# EasyEDA Pro project MAX5864_REUSE.eprj, board PCB1_1
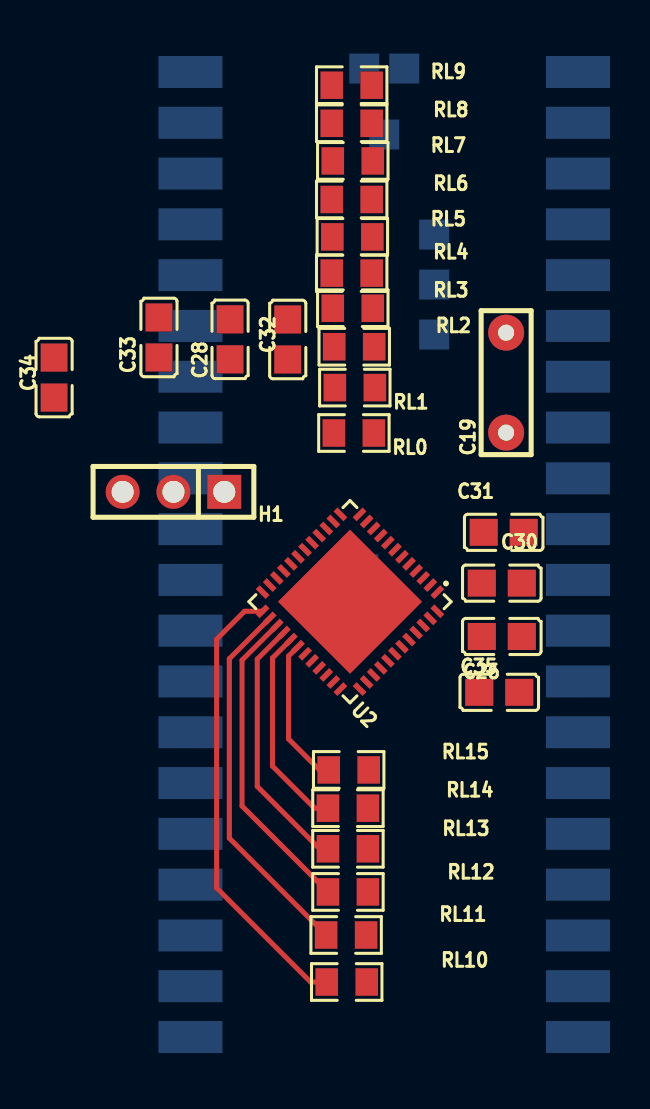
[diagram p16: board, top side]
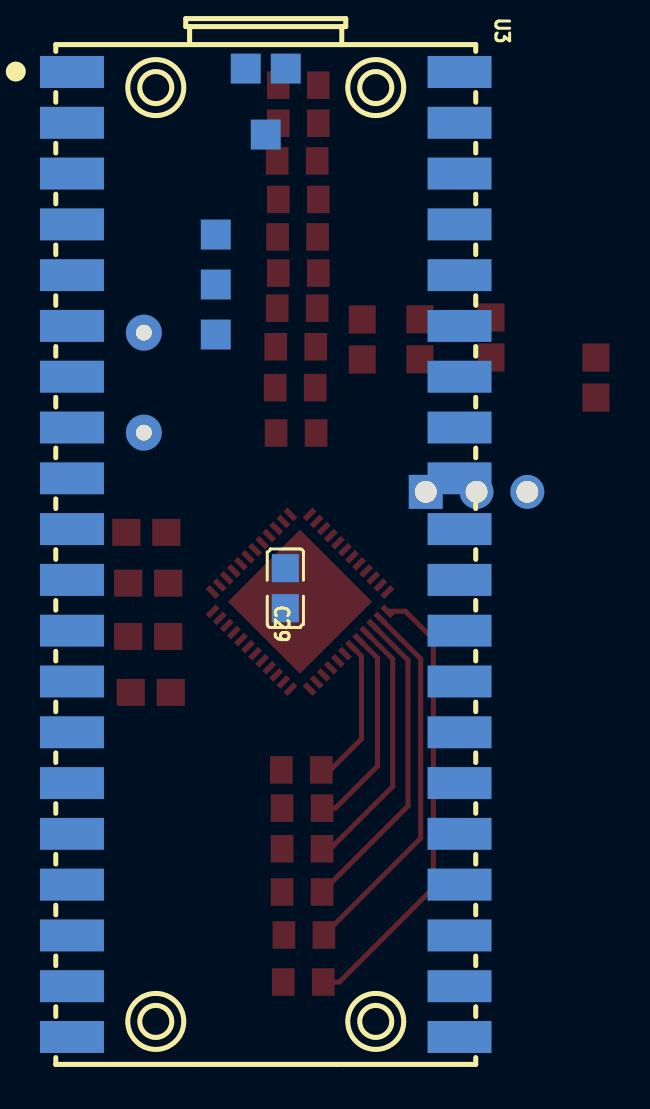
[diagram p17: board, bottom side, seen from below]

No outline. copper layers: Top Layer, Bottom Layer. Coordinates in mm from the lowest, leftmost part position.
Stack: Top Layer 0.035mm / Dielectric1 1.51mm FR4 er 4.5 / Bottom Layer 0.035mm

## Design rules (mm)
template: JLCPCB Capability(Two Layers Board)
spacing copperThickness1oz (default): track to track 0.102, other pairs 0.152 to 0.3
spacing copperThickness2oz: track to track 0.203, other pairs 0.152 to 0.3
track width copperThickness1oz (default): min 0.127, default 0.254, max 2.54
track width copperThickness2oz: min 0.203, default 0.254, max 2.54
differential pair differentialPair (default): width min 0.127, default 0.254, max 2.54; gap min 0.152, default 0.152
via viaSize (default): diameter min 0.5, default 0.61, max 10; hole min 0.3, default 0.305, max 6.3

## Placement (name value [footprint] x y rotation side)
C19  1uF  [CAP-TH_L7.2-W2.5-P5.00-D0.6]  22.61 29.97 90 top
C26  100nF  [C0805]  22.39 17.28 180 top
C28  100nF  [C0805]  8.8 32.14 90 top
C29  100nF  [C0805]  15.53 19.69 90 bottom
C30  100nF  [C0805]  22.39 19.95 0 top
C31  100nF  [C0805]  22.48 22.49 180 top
C32  100nF  [C0805]  11.68 32.13 90 top
C33  100nF  [C0805]  5.24 32.23 270 top
C34  100nF  [C0805]  0 30.23 90 top
C35  100nF  [C0805]  22.26 14.48 0 top
H1  -  [HDR-TH_3P-P2.54-V-M]  5.97 24.51 180 top
RL0  PFC-W0805LF-03-1301-B  [R0805]  14.99 27.45 180 top
RL1  PFC-W0805LF-03-1301-B  [R0805]  15.04 29.72 180 top
RL2  PFC-W0805LF-03-1301-B  [R0805]  15.01 31.77 180 top
RL3  PFC-W0805LF-03-1301-B  [R0805]  14.94 33.69 180 top
RL4  PFC-W0805LF-03-1301-B  [R0805]  14.88 35.45 180 top
RL5  PFC-W0805LF-03-1301-B  [R0805]  14.92 37.26 180 top
RL6  PFC-W0805LF-03-1301-B  [R0805]  14.88 39.13 180 top
RL7  PFC-W0805LF-03-1301-B  [R0805]  14.94 41.06 180 top
RL8  PFC-W0805LF-03-1301-B  [R0805]  14.88 42.94 180 top
RL9  PFC-W0805LF-03-1301-B  [R0805]  14.88 44.85 180 top
RL10  PFC-W0805LF-03-1301-B  [R0805]  14.63 0 180 top
RL11  PFC-W0805LF-03-1301-B  [R0805]  14.6 2.35 180 top
RL12  PFC-W0805LF-03-1301-B  [R0805]  14.69 4.5 180 top
RL13  PFC-W0805LF-03-1301-B  [R0805]  14.69 6.66 180 top
RL14  PFC-W0805LF-03-1301-B  [R0805]  14.69 8.69 180 top
RL15  PFC-W0805LF-03-1301-B  [R0805]  14.73 10.6 180 top
U2  MAX5864ETM+  [QFN-48_L7.0-W7.0-P0.50-BL-EP5.1]  14.8 19.02 135 top
U3  PICO W  [COMM-SMD_L51.0-W21.0-P2.54_PICOW]  16.51 21.46 270 bottom

## Footprints (pads in the part's own frame, mm; a bottom-side part is the same pattern mirrored in y, then rotated)
C0805
  rect 1.41x1.35 smd: 1(-1,0) 2(1,0)
CAP-TH_L7.2-W2.5-P5.00-D0.6
  round 1.8 hole 0.8: 1(-2.499,0) 2(2.499,0)
COMM-SMD_L51.0-W21.0-P2.54_PICOW
  rect 1.6x3.2 smd: 1(-24.045,-9.69) 2(-21.505,-9.69) 3(-18.965,-9.69) 4(-16.425,-9.69) 5(-13.885,-9.69) 6(-11.345,-9.69) 7(-8.805,-9.69) 8(-6.265,-9.69) 9(-3.725,-9.69) 10(-1.185,-9.69) 11(1.355,-9.69) 12(3.895,-9.69) 13(6.435,-9.69) 14(8.975,-9.69) 15(11.515,-9.69) 16(14.055,-9.69) 17(16.595,-9.69) 18(19.135,-9.69) 19(21.675,-9.69) 20(24.215,-9.69) 21(24.215,9.69) 22(21.675,9.69) 23(19.135,9.69) 24(16.595,9.69) 25(14.055,9.69) 26(11.515,9.69) 27(8.975,9.69) 28(6.435,9.69) 29(3.895,9.69) 30(1.355,9.69) 31(-1.185,9.69) 32(-3.725,9.69) 33(-6.265,9.69) 34(-8.805,9.69) 35(-11.345,9.69) 36(-13.885,9.69) 37(-16.425,9.69) 38(-18.965,9.69) 39(-21.505,9.69) 40(-24.045,9.69)
  rect 1.5x1.5 smd: TP1(-20.915,0) TP2(-24.215,1) TP3(-24.215,-1) TP4(-15.915,-2.499) TP5(-13.415,-2.499) TP6(-10.915,-2.499)
HDR-TH_3P-P2.54-V-M
  rect 1.7x1.7 hole 1.1: 1(-2.54,0)
  round 1.7 hole 1.1: 2(0,0) 3(2.54,0)
QFN-48_L7.0-W7.0-P0.50-BL-EP5.1
  rect 0.28x0.7 smd: 1(-2.75,-3.428) 2(-2.25,-3.428) 3(-1.75,-3.428) 4(-1.25,-3.428) 5(-0.75,-3.428) 6(-0.25,-3.428) 7(0.25,-3.428) 8(0.75,-3.428) 9(1.25,-3.428) 10(1.75,-3.428) 11(2.25,-3.428) 12(2.75,-3.428) 25(2.75,3.428) 26(2.25,3.428) 27(1.75,3.428) 28(1.25,3.428) 29(0.75,3.428) 30(0.25,3.428) 31(-0.25,3.428) 32(-0.75,3.428) 33(-1.25,3.428) 34(-1.75,3.428) 35(-2.25,3.428) 36(-2.75,3.428)
  rect 0.7x0.28 smd: 13(3.428,-2.75) 14(3.428,-2.25) 15(3.428,-1.75) 16(3.428,-1.25) 17(3.428,-0.75) 18(3.428,-0.25) 19(3.428,0.25) 20(3.428,0.75) 21(3.428,1.25) 22(3.428,1.75) 23(3.428,2.25) 24(3.428,2.75) 37(-3.428,2.75) 38(-3.428,2.25) 39(-3.428,1.75) 40(-3.428,1.25) 41(-3.428,0.75) 42(-3.428,0.25) 43(-3.428,-0.25) 44(-3.428,-0.75) 45(-3.428,-1.25) 46(-3.428,-1.75) 47(-3.428,-2.25) 48(-3.428,-2.75)
  rect 5.1x5.1 smd: 49(0,0)
R0805
  rect 1.133x1.377 smd: 1(-1,0) 2(1,0)

## Nets
As in the schematic, except:
GND: C19.1 C26.1 C28.1 C29.1 C30.2 C31.1 C32.1 C33.2 C35.2 U2.5 U2.7 U2.12 U2.17 U2.37 U2.42 U2.47
$1N1844: C34.2 U2.31 U2.32

Pads without a net: RL0 1; RL1 1; RL2 1; RL3 1; RL4 1; RL5 1; RL6 1; RL7 1; RL8 1; RL9 1; RL10 1; RL11 1; RL12 1; RL13 1; RL14 1; RL15 1; U2 38 49; U3 1 2 3 4 5 6 7 8 9 10 11 12 13 14 15 16 17 18 19 20 21 22 23 24 25 26 27 28 29 30 31 32 33 34 35 36 37 38 39 40 TP1 TP2 TP3 TP4 TP5 TP6

## Routing (per net, layer and track width the routed paths; a pad name or vN(x,y) marks a point on that pad's centre or on a via; arc(x,y) is an arc through that point)
BBC_DD2: length 22.8
  Top Layer w0.254: U2.25 9.52,18.54 8.13,17.14 8.13,4.7 12.83,0 RL10.2
BBC_DD3: length 18.7
  Top Layer w0.254: U2.26 8.76,16.16 8.76,7.19 RL11.2
BBC_DD4: length 15.8
  Top Layer w0.254: RL12.2 9.4,8.8 9.4,16.09 11.14,17.83
BBC_DD5: length 13.1
  Top Layer w0.254: 11.49,17.48 10.16,16.15 10.16,9.78 13.28,6.66 RL13.2
BBC_DD6: length 10.4
  Top Layer w0.254: U2.29 10.92,16.2 10.92,10.79 13.02,8.69 RL14.2
BBC_DD7: length 7.5
  Top Layer w0.254: RL15.2 13.27,10.6 11.72,12.15 11.72,16.3 U2.30
